# EAGLE design untitled (EAGLE 8.1.0)
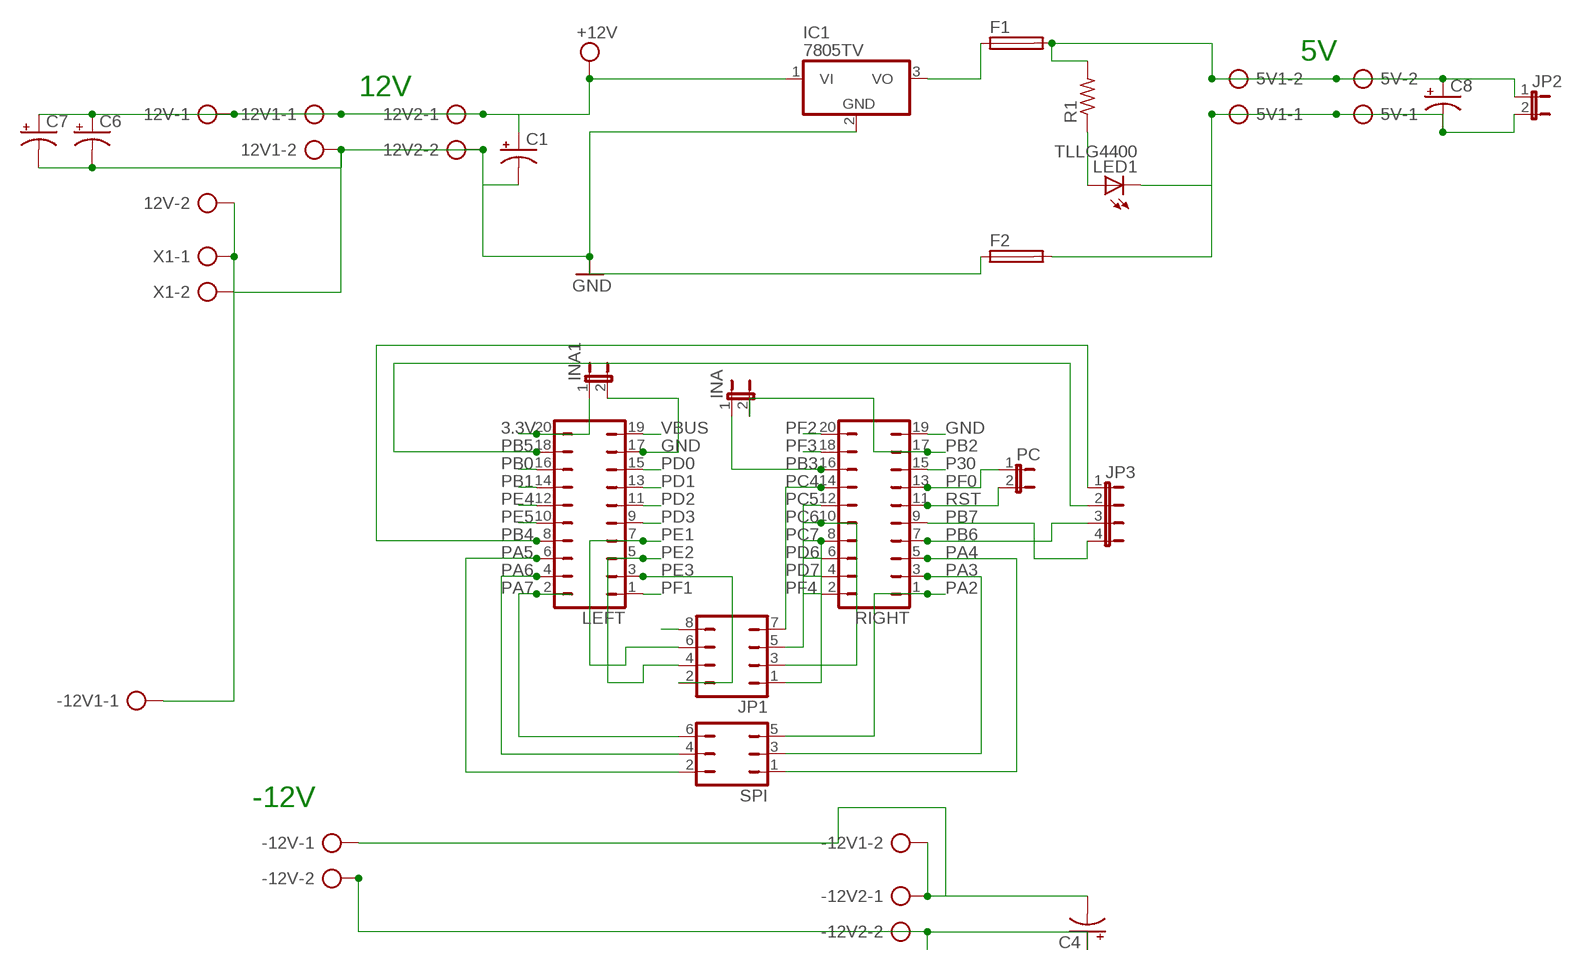
[diagram p0: schematic, sheet 1]

## Parts
5V  AK300/2  [AK300/2]
5V1  AK300/2  [AK300/2]
12V  AK300/2  [AK300/2]
12V1  AK300/2  [AK300/2]
12V2  AK300/2  [AK300/2]
-12V  AK300/2  [AK300/2]
-12V1  AK300/2  [AK300/2]
-12V2  AK300/2  [AK300/2]
C1  CPOL-USE3.5-10  [E3,5-10]
C4  CPOL-USE3.5-10  [E3,5-10]
C6  CPOL-USE3.5-10  [E3,5-10]
C7  CPOL-USE3.5-10  [E3,5-10]
C8  CPOL-USE3.5-10  [E3,5-10]
F1  GSH15  [GSH15]
F2  GSH15  [GSH15]
IC1  7805TV  [TO220V]
INA  JP1E  [JP1]
INA1  JP1E  [JP1]
JP1  JP4Q  [JP4Q]
JP2  JP1E  [JP1]
JP3  JP4E  [JP4]
LED1  TLLG4400  [LED3MM]
LEFT  JP10Q  [JP10Q]
PC  JP1E  [JP1]
R1  R-US_0207/10  [0207/10]
RIGHT  JP10Q  [JP10Q]
SPI  JP3Q  [JP3Q]
X1  AK300/2  [AK300/2]

## Nets
3.3V: INA1.1 LEFT.20
GND: 12V1.2 12V2.2 -12V2.2 -12V.2 C1.- C4.+ C6.- C7.- F2.1 IC1.2(GND) INA1.2 JP1.8 LEFT.17 RIGHT.19 X1.2
N$1: F1.1 IC1.3(VO)
N$2: 5V1.2 5V.2 C8.+ F1.2 JP2.1 R1.2
N$3: 5V1.1 5V.1 C8.- F2.2 JP2.2 LED1.K(C)
N$4: LED1.A R1.1
N$5: 12V.2 -12V1.1 X1.1
N$6: -12V1.2 -12V2.1 -12V.1 C4.-
P30: RIGHT.15
PA2: RIGHT.1 SPI.5
PA3: RIGHT.3 SPI.3
PA4: RIGHT.5 SPI.1
PA5: LEFT.6 SPI.2
PA6: LEFT.4 SPI.4
PA7: LEFT.2 SPI.6
PB0: LEFT.16
PB1: LEFT.14
PB2: INA.2 RIGHT.17
PB3: INA.1 RIGHT.16
PB4: JP3.1 LEFT.8
PB5: JP3.2 LEFT.18
PB6: JP3.3 RIGHT.7
PB7: JP3.4 RIGHT.9
PC4: JP1.7 RIGHT.14
PC5: JP1.5 RIGHT.12
PC6: JP1.3 RIGHT.10
PC7: JP1.1 RIGHT.8
PD0: LEFT.15
PD1: LEFT.13
PD2: LEFT.11
PD3: LEFT.9
PD6: RIGHT.6
PD7: RIGHT.4
PE1: JP1.6 LEFT.7
PE2: JP1.4 LEFT.5
PE3: JP1.2 LEFT.3
PE4: LEFT.12
PE5: LEFT.10
PF0: PC.1 RIGHT.13
PF1: LEFT.1
PF2: RIGHT.20
PF3: RIGHT.18
PF4: RIGHT.2
RST: PC.2 RIGHT.11
VBUS: LEFT.19
VDD: 12V1.1 12V2.1 12V.1 C1.+ C6.+ C7.+ IC1.1(VI) ; supply symbol labelled +12V

## Notes on the sheet
- 5V
- 12V
- -12V

## Library data of the parts
5V 5V1 12V 12V1 12V2 -12V -12V1 -12V2 X1 = con-ptr500:AK300/2: CONNECTOR; OC_FARNELL: unknown; OC_NEWARK: unknown
C1 C4 C6-C8 = rcl:CPOL-US: POLARIZED CAPACITOR, American symbol
F1 F2 = fuse:GSH15: FUSE HOLDER grid 15mm, 19649 Wickmann; MPN: 64900001039; OC_FARNELL: 1271673; OC_NEWARK: 02P0318
IC1 = linear:78*: Positive VOLTAGE REGULATOR Source: http://cache.national.com/ds/LM/LM78L05.pdf http://www.fairchildsemi.com/ds/LM/LM7805.pdf
INA INA1 JP2 PC = jumper:JP1E: JUMPER
JP1 = jumper:JP4Q: JUMPER
JP3 = jumper:JP4E: JUMPER
LED1 = led:TLLG4400: Low Current (2mA) LED 3 mm Tinted Diffused Package color GREEN Source: Data sheet <http://www.farnell.com/datasheets/391098.pdf>; MF: VISHAY SEMICONDUCTOR; OC_FARNELL: 1612435
LEFT RIGHT = jumper:JP10Q: JUMPER
R1 = resistor:R-US_: RESISTOR, American symbol
SPI = jumper:JP3Q: JUMPER

## Net classes
0 default: clearance 0.457 mm

## Board
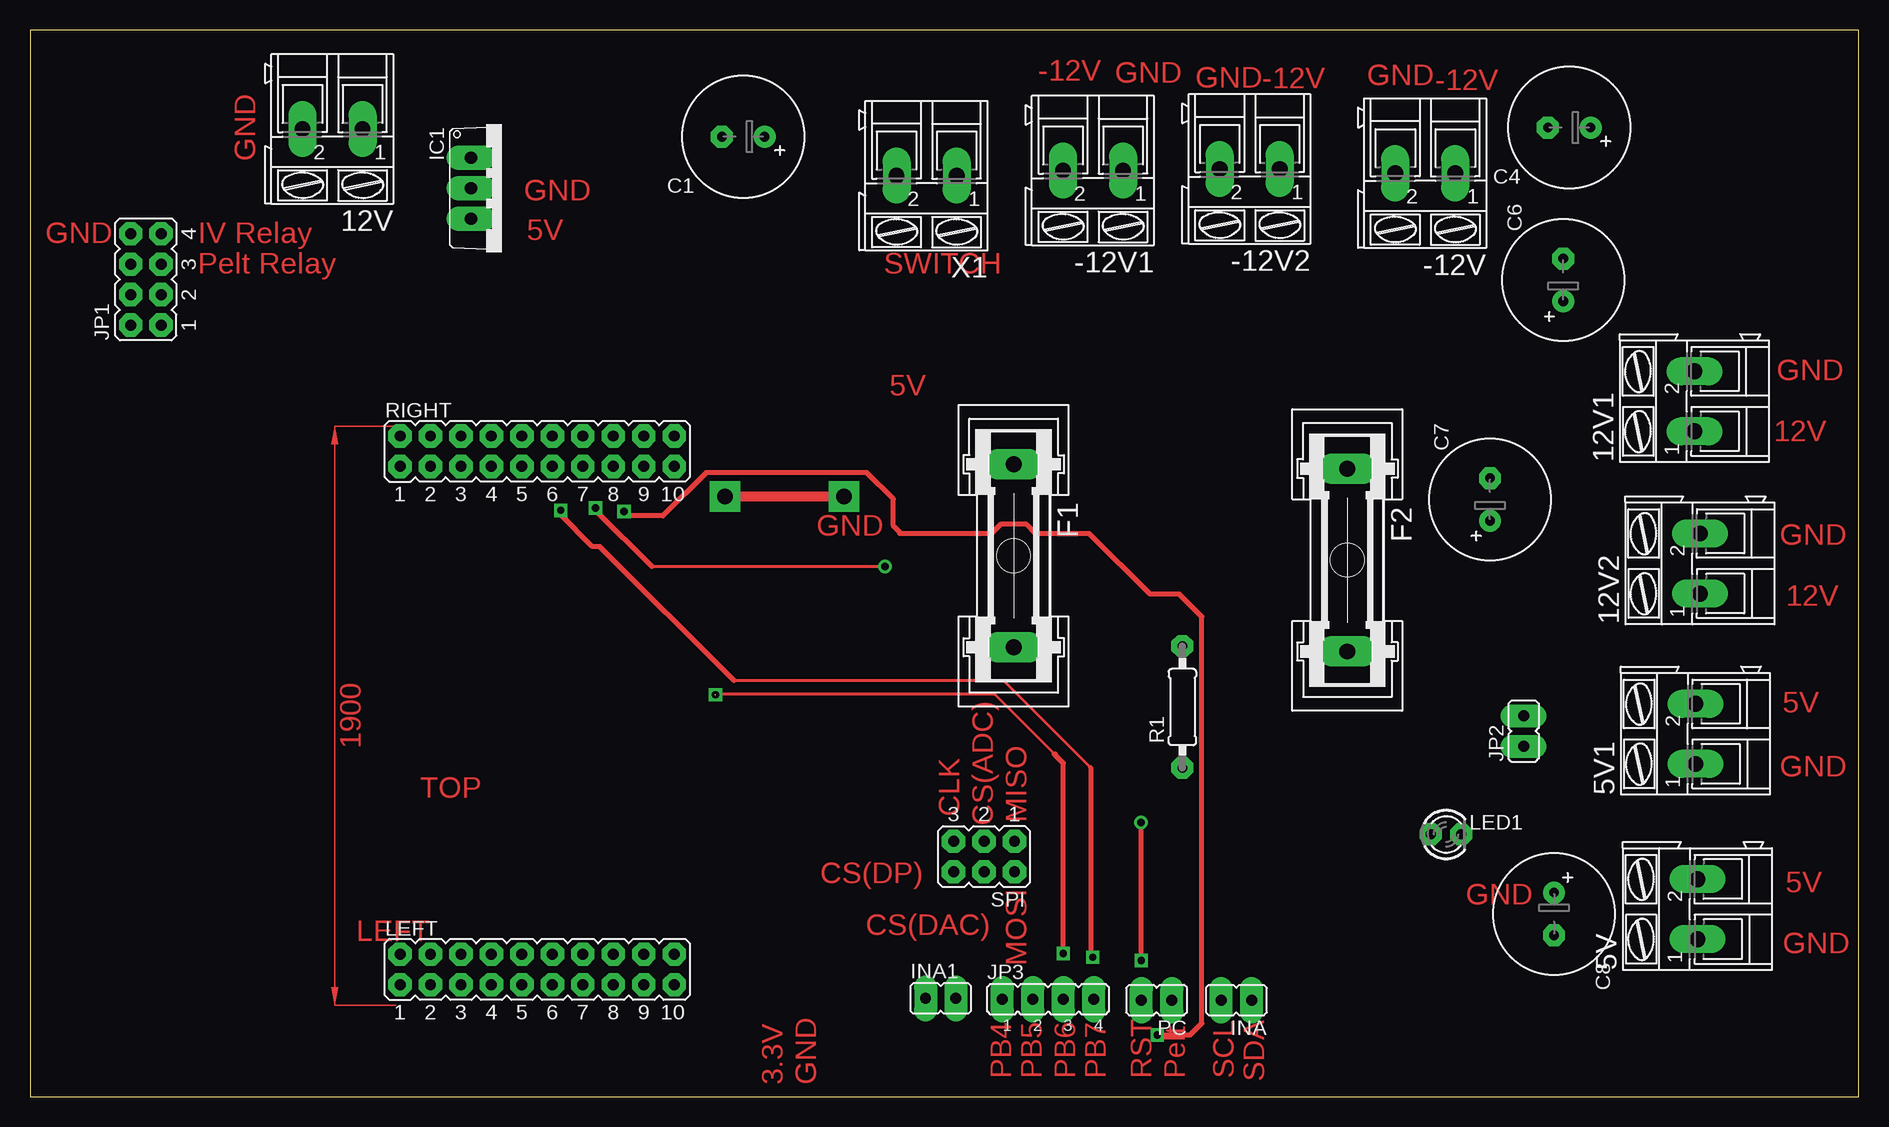
[diagram p1: board, top side]
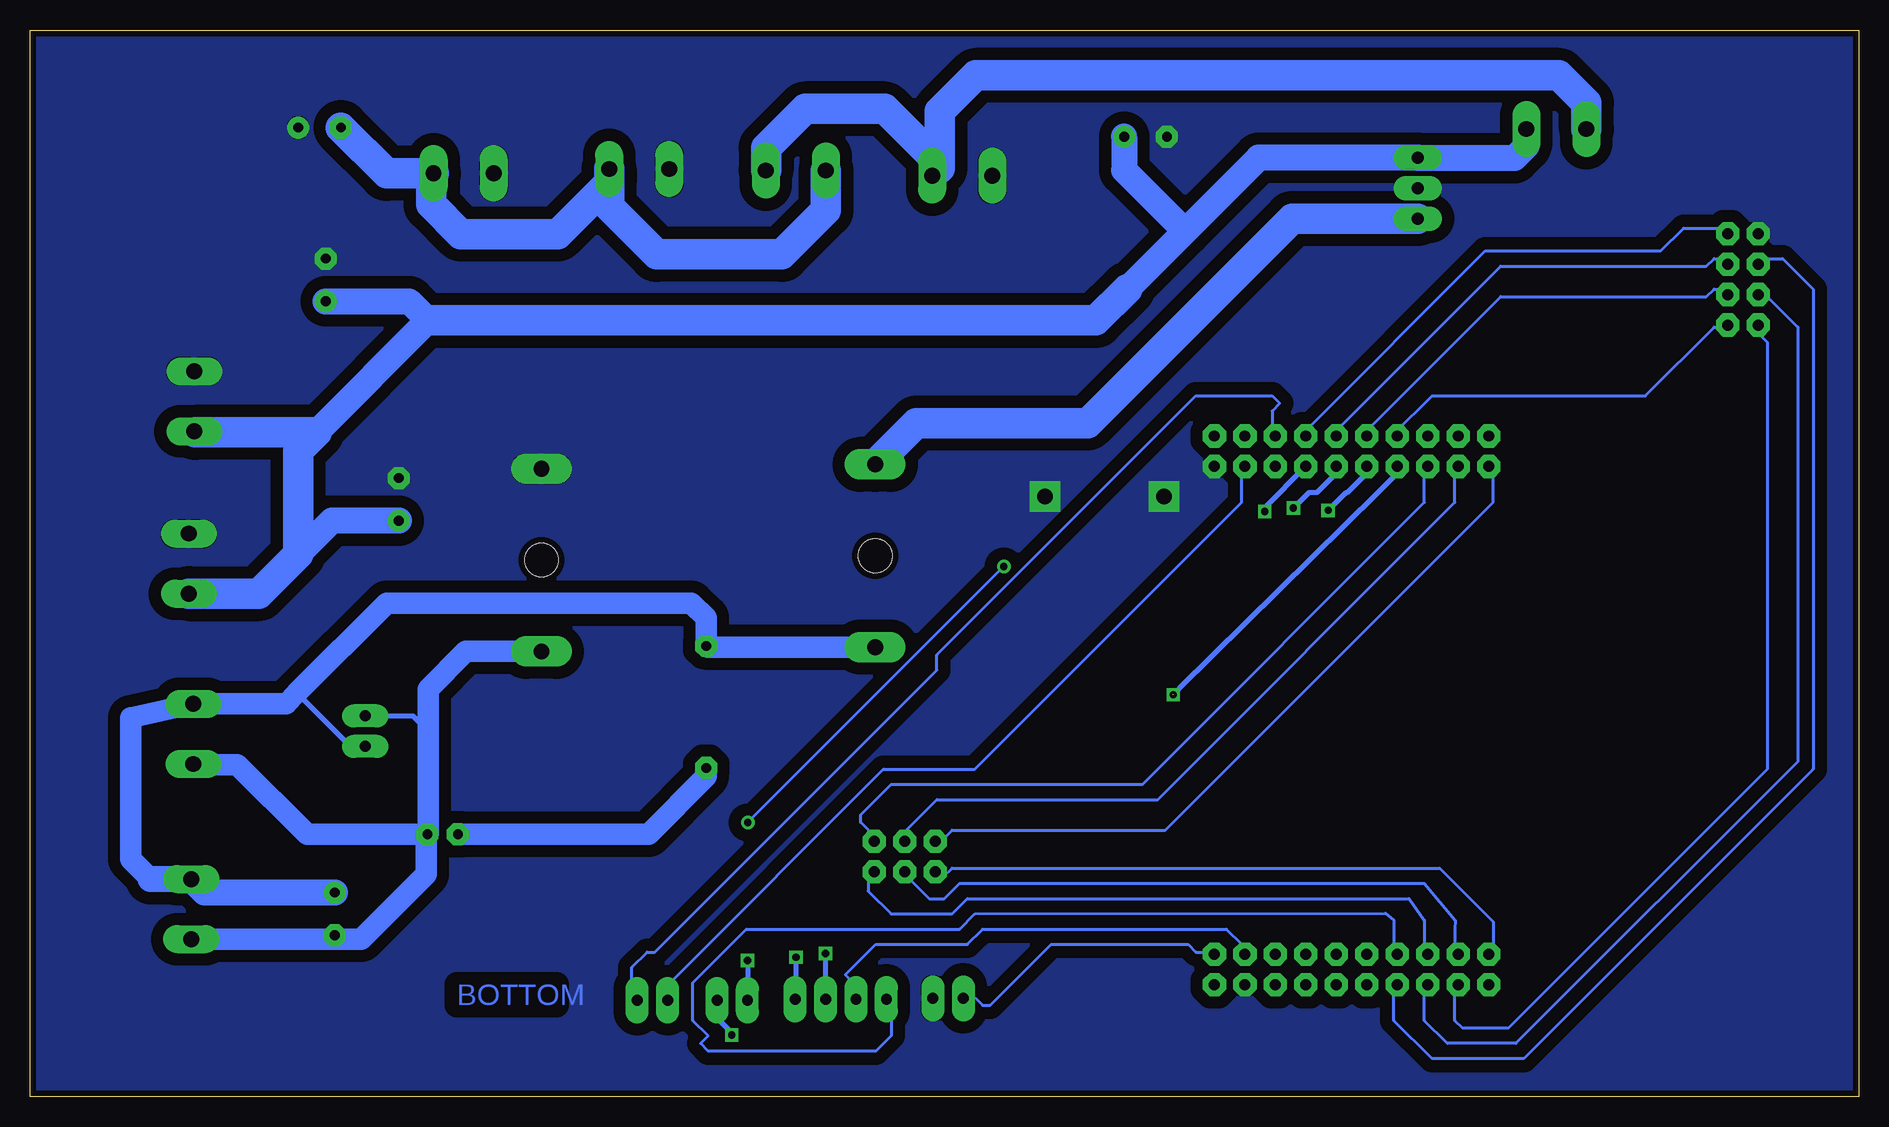
[diagram p2: board, bottom side, seen from below]

Size 152.4 x 88.9 mm. Coordinates in mm from the lower left corner, seen from the top.
Outline: 0,0 152.4,0 152.4,88.9 0,88.9 0,0
Copper layers (1*16): Top 0.035mm / dielectric 1.5mm / Bottom 0.035mm
Design rules "default *": minimum track width 10mil, minimum drill 24mil, track to track 40mil, track to pad 40mil, pad to pad 40mil, via to via 40mil, smd to smd 8mil, copper to edge 20mil, drill to drill 8mil, minimum pad ring 20mil, minimum via ring 10mil, stop-mask expansion 4mil, vias tented up to drill 0mil, thermal gap 2mil

### Footprints (pad centres in the part's own frame; a part is rotated, then mirrored left to right if it is on the bottom)
AK300/2 = drill 1.321 long: 1 -2.515,0; 2 2.489,0
E3,5-10 = drill 0.813 pad 1.6: + -1.778,0 | drill 0.813 pad 1.6 octagon: - 1.778,0
GSH15 = drill 1.321 pad 2.54 long: 1 -7.62,0; 2 7.62,0 | hole 2.794: 0,0
TO220V = drill 1.016 long: 1 -2.54,-2.54; 2 0,-2.54; 3 2.54,-2.54
JP1 = drill 0.914 long: 1 0,-1.27; 2 0,1.27
JP4Q = drill 0.914 octagon: 1 -3.81,-1.27; 2 -3.81,1.27; 3 -1.27,-1.27; 4 -1.27,1.27; 5 1.27,-1.27; 6 1.27,1.27; 7 3.81,-1.27; 8 3.81,1.27
JP4 = drill 0.914 long: 1 -3.81,0; 2 -1.27,0; 3 1.27,0; 4 3.81,0
LED3MM = drill 0.813 octagon: A -1.27,0; K 1.27,0
JP10Q = drill 0.914 octagon: 1 -11.43,-1.27; 2 -11.43,1.27; 3 -8.89,-1.27; 4 -8.89,1.27; 5 -6.35,-1.27; 6 -6.35,1.27; 7 -3.81,-1.27; 8 -3.81,1.27; 9 -1.27,-1.27; 10 -1.27,1.27; 11 1.27,-1.27; 12 1.27,1.27; 13 3.81,-1.27; 14 3.81,1.27; 15 6.35,-1.27; 16 6.35,1.27; 17 8.89,-1.27; 18 8.89,1.27; 19 11.43,-1.27; 20 11.43,1.27
0207/10 = drill 0.813 octagon: 1 -5.08,0; 2 5.08,0
JP3Q = drill 0.914 octagon: 1 -2.54,-1.27; 2 -2.54,1.27; 3 0,-1.27; 4 0,1.27; 5 2.54,-1.27; 6 2.54,1.27

### Placement (x,y rotation side)
5V  138.96,15.65 90 top
5V1  138.79,30.25 90 top
12V  25.2,80.64 180 top
12V1  138.71,57.96 90 top
12V2  139.17,44.45 90 top
-12V  116.26,76.96 180 top
-12V1  88.57,77.19 180 top
-12V2  101.63,77.32 180 top
C1  59.44,80.01 180 top
C4  128.27,80.77 180 top
C6  127.76,68.07 90 top
C7  121.67,49.78 90 top
C8  127,15.24 270 top
F1  81.97,45.09 270 top
F2  109.78,44.73 270 top
IC1  39.29,75.72 270 top
INA  100.53,8.05 90 top
INA1  75.9,8.2 270 top
JP1  9.65,68.12 90 top
JP2  124.46,30.48 0 top
JP3  84.84,8.13 0 top
LED1  118.01,21.87 0 top
LEFT  42.27,10.62 0 top
PC  93.88,8.05 90 top
R1  96.04,32.49 90 top
RIGHT  42.27,53.8 0 top
SPI  79.5,20.02 180 top
X1  74.7,76.76 180 top

### Tracks (layer width: path | path; a pad name or v marks a point on that pad's centre or on a via)
3.3V
  Bottom 0.254: LEFT.20 53.98,12.06 55.24,12.06 55.88,12.7 67.31,12.7 72.39,7.62 73.03,7.62 74.3,8.89 74.93,8.26 INA1.1
GND  (via drill 1.3 pad 2.54)
  Top 0.813: v57.91,50.04 v67.82,50.04
  pour Bottom: 0,0.05 152.4,0.05 152.4,88.95 0,88.95
N$1
  Bottom 2.54: IC1.3 47.22,73.18 64.26,56.13 78.54,56.13 F1.1
N$2
  Bottom 0.406: JP2.1 125.73,29.21 130.18,33.66
  Bottom 0.813: 95.94,37.47 R1.2 | 138.76,32.77 5V1.2
  Bottom 1.778: F1.2 95.94,37.47 | 142.34,18.14 144.02,19.81 144.02,31.57 5V1.2 | R1.2 96.04,39.9 97.28,41.15 122.68,41.15 130.18,33.66 131.06,32.77 138.76,32.77
  Bottom 2.184: 142.34,18.14 5V.2 137.85,17.02 C8.+
N$3
  Bottom 0.406: JP2.2 120.5,31.75 119.23,30.48
  Bottom 0.813: 119.23,21.92 LED1.K 119.38,21.77 | 138.74,27.69 5V1.1
  Bottom 1.016: C8.- 125.12,13.46 124.79,13.13
  Bottom 1.778: F2.2 116.08,37.11 119.23,33.96 119.23,30.48 119.23,21.92 | 5V.1 124.79,13.13 119.38,18.54 119.38,21.77 | LED1.K 129.31,21.87 135.13,27.69 138.74,27.69
N$4
  Bottom 1.778: R1.1 96.04,26.7 100.84,21.89 116.71,21.89 LED1.A
N$5
  Bottom 0.406: 77.22,78.36 X1.1 76.58,77.39 | 91.06,77.22 -12V1.1
  Bottom 2.54: 77.22,78.36 81.18,82.32 87.81,82.32 91.06,79.07 91.06,77.22 | 12V.2 22.71,82.83 24.99,85.11 73.58,85.11 76.58,82.12 76.58,77.39
N$6
  Bottom 0.406: 118.97,76.76 -12V.1
  Bottom 2.54: -12V.1 122.68,76.96 C4.- | -12V1.2 86.08,73.86 89.74,70.21 100.18,70.21 104.14,74.17 -12V2.1 104.14,76.17 108.43,71.88 116.48,71.88 118.97,74.37 118.97,76.76
PA2
  Bottom 0.254: RIGHT.1 30.48,52.07 30.48,49.53 57.78,22.23 75.56,22.23 76.83,20.95 SPI.5
PA3
  Bottom 0.254: RIGHT.3 33.66,52.07 33.66,49.53 58.42,24.77 76.83,24.77 80.01,21.59 SPI.3
PA4
  Bottom 0.254: RIGHT.5 36.2,52.07 36.2,49.53 59.69,26.04 80.64,26.04 83.19,23.5 83.19,22.86 81.92,21.59 SPI.1
PA5
  Bottom 0.254: LEFT.6 36.2,12.06 36.2,14.73 37.47,16.51 74.3,16.51 75.56,15.24 80.64,15.24 82.55,17.14 82.55,18.41 SPI.2
PA6
  Bottom 0.254: LEFT.4 33.66,12.06 33.66,13.97 33.63,14.71 36.2,17.78 74.93,17.78 76.2,16.51 77.47,16.51 79.38,18.41 SPI.4
PA7
  Bottom 0.254: LEFT.2 30.48,12.06 30.48,14.61 34.92,19.05 75.56,19.05 76.2,18.41 76.83,18.41 SPI.6
PB2
  Bottom 0.254: RIGHT.17 51.44,52.07 51.44,49.53 73.66,27.3 81.28,27.3 99.06,9.53 99.06,8.26 INA.2
PB3
  Bottom 0.254: RIGHT.16 48.9,55.24 48.9,57.15 48.26,57.78 48.9,58.42 55.24,58.42 76.83,36.83 76.83,35.56 100.33,12.06 100.97,12.06 102.23,10.79 102.23,8.26 INA.1
PB4
  Bottom 0.254: LEFT.8 38.73,12.06 38.73,13.97 38.76,14.73 39.45,15.32 73.66,15.24 74.93,13.97 92.71,13.97 97.16,9.53 97.16,6.35 95.89,5.08 96.52,4.45 95.89,3.81 81.92,3.81 80.64,5.08 80.64,7.62 JP3.1
PB5
  Bottom 0.254: 83.82,8 JP3.2 83.82,8.26 83.82,9.53 84.45,10.16 81.92,12.7 74.3,12.7 73.03,13.97 52.7,13.97 51.44,12.7 51.44,12.06 LEFT.18
PB6  (via drill 0.6)  (1 unrouted)
  Top 0.254: 57.15,33.53 80.39,33.53 85.34,28.57 | 38.48,52.2 RIGHT.7
  Top 0.406: v86.11,11.94 86.11,27.81 85.41,28.51 85.47,28.57 85.34,28.57
  Bottom 0.406: RIGHT.7 38.46,51.98 40.09,50.34 40.08,50.34 56.64,34.04 56.64,33.98 v57.12,33.5 | JP3.3 86.11,11.68 86.36,11.94 v86.11,11.94
PB7  (via drill 0.6)
  Top 0.254: 88.39,27.43 81.15,34.67 58.67,34.67 | 41.15,52.2 RIGHT.9
  Top 0.406: 58.67,34.67 47.5,45.85 46.86,45.85 44.22,48.49 v44.22,48.87 | 88.39,27.43 88.39,12.04 88.59,11.84 88.59,11.66 v88.57,11.63
  Bottom 0.406: v44.22,48.87 42.75,50.34 42.63,50.34 41,51.98 RIGHT.9 | v88.57,11.63 88.57,8.2 JP3.4
PC4
  Bottom 0.254: JP1.7 11.43,72.39 14.61,72.39 16.51,70.48 31.11,70.48 46.35,55.24 RIGHT.14
PC5
  Bottom 0.254: JP1.5 11.43,69.85 12.06,69.85 12.7,69.22 29.84,69.22 43.81,55.24 RIGHT.12
PC6
  Bottom 0.254: JP1.3 11.43,67.31 12.06,67.31 12.7,66.67 29.84,66.67 41.27,55.24 RIGHT.10
PC7
  Bottom 0.254: JP1.1 11.43,64.14 12.06,64.14 17.78,58.42 35.56,58.42 38.73,55.24 RIGHT.8
PE1
  Bottom 0.254: LEFT.7 38.73,8.89 38.73,6.35 35.56,3.17 27.94,3.17 3.81,27.3 3.81,67.31 6.35,69.85 8.26,69.85 JP1.6
PE2
  Bottom 0.254: LEFT.5 36.2,8.89 36.2,6.35 34.29,4.45 28.57,4.45 5.08,27.94 5.08,64.14 8.26,67.31 JP1.4
PE3
  Bottom 0.254: LEFT.3 33.66,8.89 33.66,6.35 33.02,5.71 29.21,5.71 7.62,27.3 7.62,62.87 8.89,64.14 JP1.2
PF0  (via drill 0.6)
  Top 0.406: v93.93,5.16 96.7,5.16 97.66,6.12 97.66,40.01 95.78,41.88 93.34,41.88 88.29,46.94 83.81,46.94 83.05,47.7 80.88,47.7 80.12,46.94 72.59,46.94 | 72.59,46.94 72.46,46.94 | 72.59,46.94 71.95,47.58 71.95,49.82 69.75,52.02 56.35,52.02 52.74,48.41 49.86,48.41 v49.51,48.77
  Bottom 0.406: PC.1 95.15,6.54 93.77,5.16 v93.93,5.16 | v49.51,48.77 49.51,49.1 RIGHT.13
RST  (via drill 0.6, 0.61)
  Top 0.254: 51.82,44.2 v71.25,44.2 | 92.58,8.38 PC.2 | 43.81,52.2 RIGHT.11
  Top 0.406: v47.12,49.07 47.12,48.9 51.82,44.2 | v92.58,22.86 92.58,11.51 92.56,11.48 92.56,11.4 v92.61,11.35
  Bottom 0.254: v71.25,44.2 v92.58,22.86
  Bottom 0.406: RIGHT.11 43.89,52.17 43.89,51.62 45.17,50.34 45.82,50.34 47.17,49 47.12,49 v47.12,49.07 | v92.61,11.35 PC.2
VDD
  Bottom 0.813: 36.7,78.21 IC1.1 36.73,78.23 | 138.63,55.37 12V1.1
  Bottom 1.016: 121.67,47.75 C7.+
  Bottom 2.184: 128.52,55.37 119.2,64.69 120.8,66.29 C6.+ | 12V.1 27.71,79.22 28.7,78.23 36.73,78.23 | C7.+ 127.25,48.01 130.05,45.21 | IC1.1 50.01,78.26 56.13,72.14 | 60.96,67.31 56.13,72.14 | C1.+ 61.21,77.22 56.13,72.14
  Bottom 2.54: 138.63,55.37 128.52,55.37 130.05,53.85 130.05,45.21 133.32,41.94 12V2.1 | 119.2,64.69 63.58,64.69 60.96,67.31
(copper drawn outside any net)
  shapes: Top area x1

### Text on the board
Top: -12V | GND | GND | -12V | GND | -12V | GND | GND | GND | IV Relay | 5V | Pelt Relay | SWITCH | GND | 5V | 12V | GND | GND | 12V | 5V | GND | TOP | CLK | CS(ADC) | MISO | CS(DP) | 5V | GND | CS(DAC) | LEFT | GND | MOSI | PB4 | PB5 | PB6 | PB7 | RST | Pelt | SCL | 3.3V | GND | SDA
Bottom: BOTTOM